# EAGLE schematic IAS_v005 (EAGLE 7.3.0)
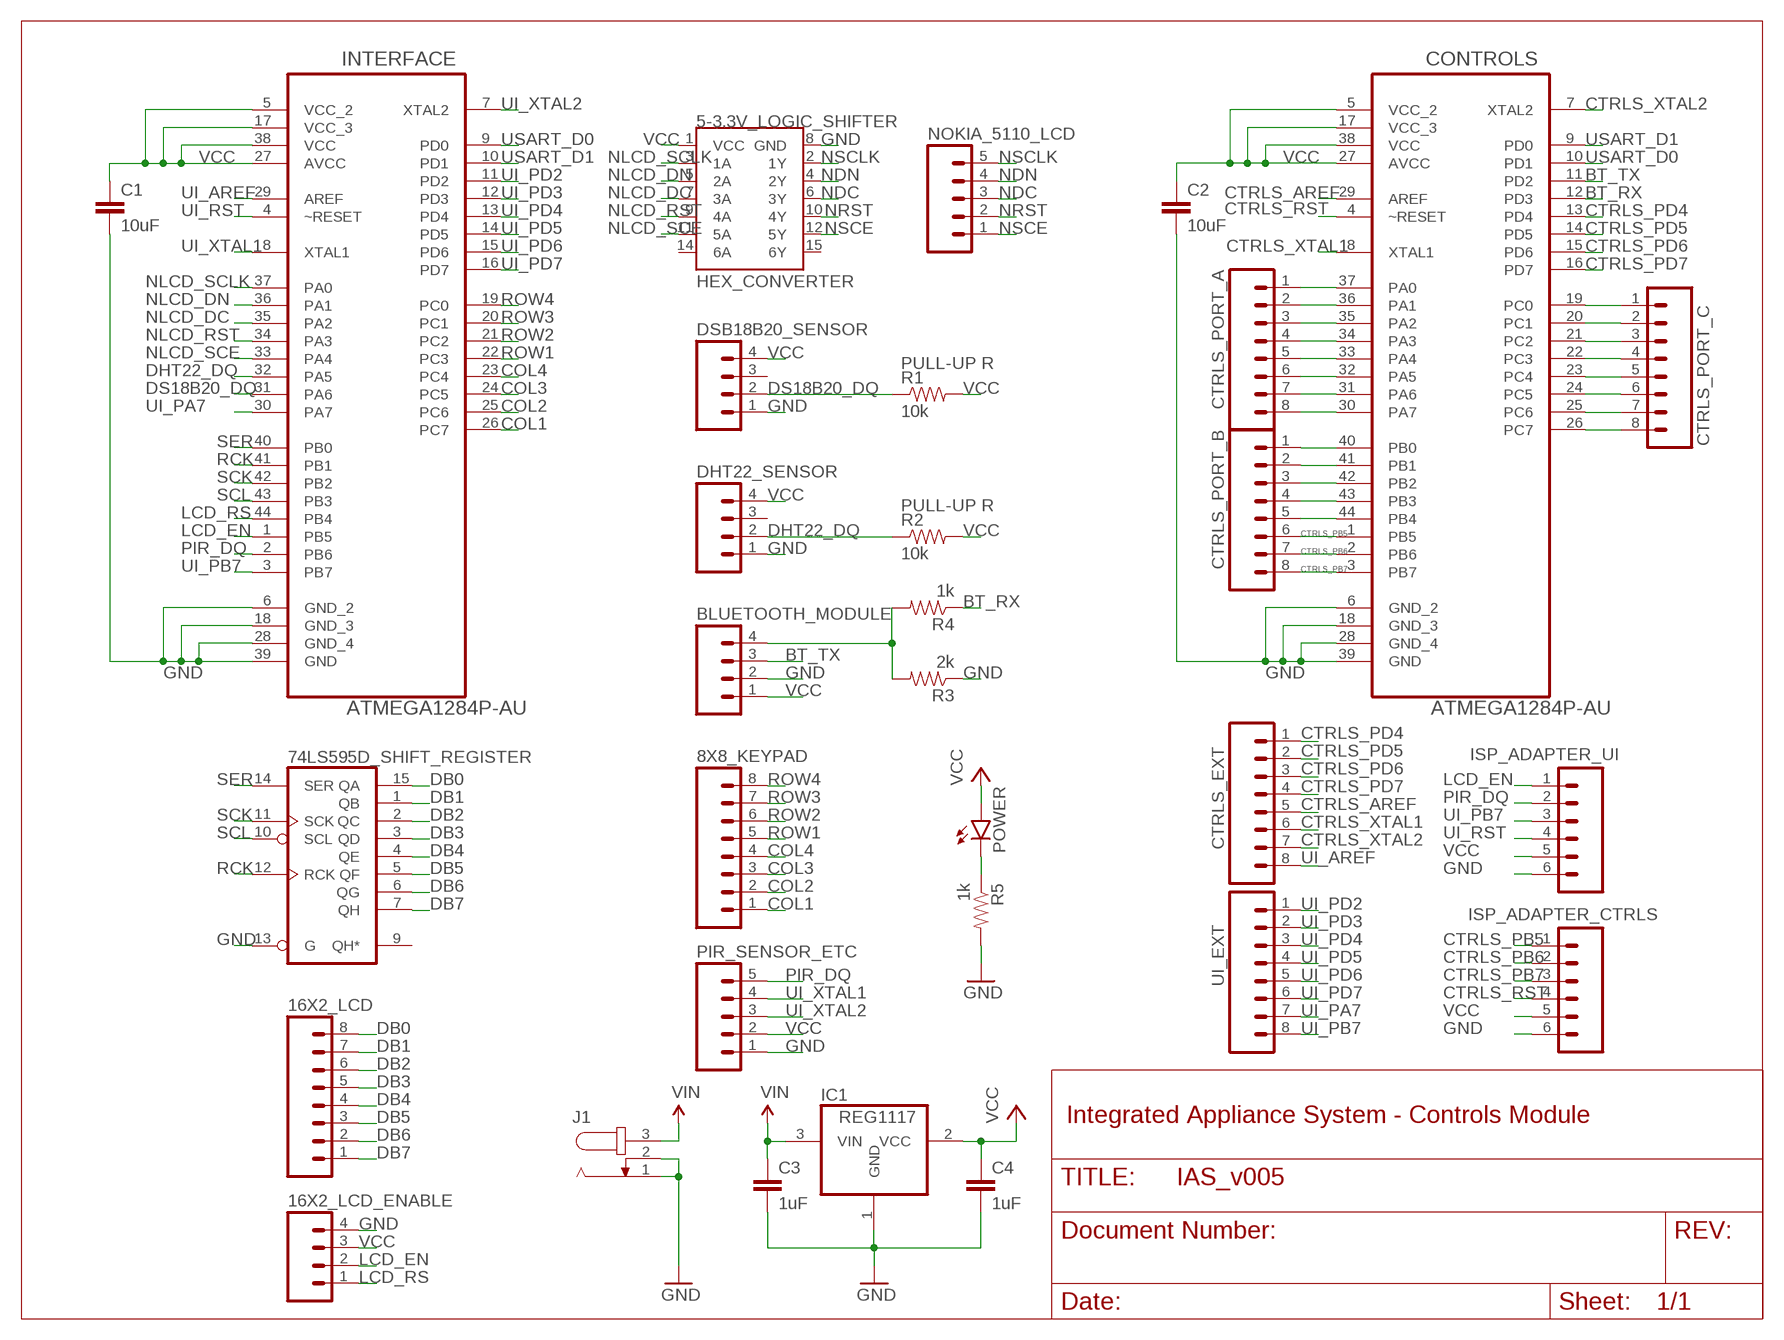
[diagram p0: schematic, sheet 1]

## Parts
5-3.3V_LOGIC_SHIFTER  HEX_CONVERTER  [SO016]
8X8_KEYPAD  M08  [1X08_ROUND]
16X2_LCD  M08  [1X08_ROUND]
16X2_LCD_ENABLE  M04NO_SILK_ALL_ROUND  [1X04_NO_SILK_ALL_ROUND]
74LS595D_SHIFT_REGISTER  74LS595D  [SO16]
BLUETOOTH_MODULE  M04NO_SILK_ALL_ROUND  [1X04_NO_SILK_ALL_ROUND]
C1  10uF  CAP1206  [1206]
C2  10uF  CAP1206  [1206]
C3  1uF  CAP1206  [1206]
C4  1uF  CAP1206  [1206]
CONTROLS  ATMEGA1284P-AU  [QFP80P1200X1200X120-44N]
CTRLS_EXT  M08  [1X08_ROUND]
CTRLS_PORT_A  M08  [1X08_ROUND]
CTRLS_PORT_B  M08  [1X08_ROUND]
CTRLS_PORT_C  M08  [1X08_ROUND]
DHT22_SENSOR  M04NO_SILK_ALL_ROUND  [1X04_NO_SILK_ALL_ROUND]
DSB18B20_SENSOR  M04NO_SILK_ALL_ROUND  [1X04_NO_SILK_ALL_ROUND]
IC1  REG1117  [SOT223]
INTERFACE  ATMEGA1284P-AU  [QFP80P1200X1200X120-44N]
ISP_ADAPTER_CTRLS  M06SILK_FEMALE_PTH  [1X06]
ISP_ADAPTER_UI  M06SILK_FEMALE_PTH  [1X06]
J1  JACK-PLUG0  [SPC4077]
NOKIA_5110_LCD  M05PTH  [1X05]
PIR_SENSOR_ETC  M05PTH  [1X05]
POWER  LED3MM  [LED3MM]
R1  10k  RESISTOR1206  [1206]
R2  10k  RESISTOR1206  [1206]
R3  2k  RESISTOR1206  [1206]
R4  1k  RESISTOR1206  [1206]
R5  1k  RESISTOR1206  [1206]
UI_EXT  M08  [1X08_ROUND]

## Nets
BT_RX: CONTROLS.12(PD3) R4.1
BT_TX: BLUETOOTH_MODULE.3 CONTROLS.11(PD2)
COL1: 8X8_KEYPAD.1 INTERFACE.26(PC7)
COL2: 8X8_KEYPAD.2 INTERFACE.25(PC6)
COL3: 8X8_KEYPAD.3 INTERFACE.24(PC5)
COL4: 8X8_KEYPAD.4 INTERFACE.23(PC4)
CTRLS_AREF: CONTROLS.29(AREF) CTRLS_EXT.5
CTRLS_PA0: CONTROLS.37(PA0) CTRLS_PORT_A.1
CTRLS_PA1: CONTROLS.36(PA1) CTRLS_PORT_A.2
CTRLS_PA2: CONTROLS.35(PA2) CTRLS_PORT_A.3
CTRLS_PA3: CONTROLS.34(PA3) CTRLS_PORT_A.4
CTRLS_PA4: CONTROLS.33(PA4) CTRLS_PORT_A.5
CTRLS_PA5: CONTROLS.32(PA5) CTRLS_PORT_A.6
CTRLS_PA6: CONTROLS.31(PA6) CTRLS_PORT_A.7
CTRLS_PA7: CONTROLS.30(PA7) CTRLS_PORT_A.8
CTRLS_PB0: CONTROLS.40(PB0) CTRLS_PORT_B.1
CTRLS_PB1: CONTROLS.41(PB1) CTRLS_PORT_B.2
CTRLS_PB2: CONTROLS.42(PB2) CTRLS_PORT_B.3
CTRLS_PB3: CONTROLS.43(PB3) CTRLS_PORT_B.4
CTRLS_PB4: CONTROLS.44(PB4) CTRLS_PORT_B.5
CTRLS_PB5: CONTROLS.1(PB5) CTRLS_PORT_B.6 ISP_ADAPTER_CTRLS.1
CTRLS_PB6: CONTROLS.2(PB6) CTRLS_PORT_B.7 ISP_ADAPTER_CTRLS.2
CTRLS_PB7: CONTROLS.3(PB7) CTRLS_PORT_B.8 ISP_ADAPTER_CTRLS.3
CTRLS_PC0: CONTROLS.19(PC0) CTRLS_PORT_C.1
CTRLS_PC1: CONTROLS.20(PC1) CTRLS_PORT_C.2
CTRLS_PC2: CONTROLS.21(PC2) CTRLS_PORT_C.3
CTRLS_PC3: CONTROLS.22(PC3) CTRLS_PORT_C.4
CTRLS_PC4: CONTROLS.23(PC4) CTRLS_PORT_C.5
CTRLS_PC5: CONTROLS.24(PC5) CTRLS_PORT_C.6
CTRLS_PC6: CONTROLS.25(PC6) CTRLS_PORT_C.7
CTRLS_PC7: CONTROLS.26(PC7) CTRLS_PORT_C.8
CTRLS_PD4: CONTROLS.13(PD4) CTRLS_EXT.1
CTRLS_PD5: CONTROLS.14(PD5) CTRLS_EXT.2
CTRLS_PD6: CONTROLS.15(PD6) CTRLS_EXT.3
CTRLS_PD7: CONTROLS.16(PD7) CTRLS_EXT.4
CTRLS_RST: CONTROLS.4(~RESET) ISP_ADAPTER_CTRLS.4
CTRLS_XTAL1: CONTROLS.8(XTAL1) CTRLS_EXT.6
CTRLS_XTAL2: CONTROLS.7(XTAL2) CTRLS_EXT.7
DB0: 16X2_LCD.8 74LS595D_SHIFT_REGISTER.15(QA)
DB1: 16X2_LCD.7 74LS595D_SHIFT_REGISTER.1(QB)
DB2: 16X2_LCD.6 74LS595D_SHIFT_REGISTER.2(QC)
DB3: 16X2_LCD.5 74LS595D_SHIFT_REGISTER.3(QD)
DB4: 16X2_LCD.4 74LS595D_SHIFT_REGISTER.4(QE)
DB5: 16X2_LCD.3 74LS595D_SHIFT_REGISTER.5(QF)
DB6: 16X2_LCD.2 74LS595D_SHIFT_REGISTER.6(QG)
DB7: 16X2_LCD.1 74LS595D_SHIFT_REGISTER.7(QH)
DHT22_DQ: DHT22_SENSOR.2 INTERFACE.32(PA5) R2.1
DS18B20_DQ: DSB18B20_SENSOR.2 INTERFACE.31(PA6) R1.1
GND: 5-3.3V_LOGIC_SHIFTER.8(GND) 16X2_LCD_ENABLE.4 74LS595D_SHIFT_REGISTER.13(G) BLUETOOTH_MODULE.2 C1.2 C2.2 C3.2 C4.2 CONTROLS.6(GND_2) CONTROLS.18(GND_3) CONTROLS.28(GND_4) CONTROLS.39(GND) DHT22_SENSOR.1 DSB18B20_SENSOR.1 IC1.1(GND) INTERFACE.6(GND_2) INTERFACE.18(GND_3) INTERFACE.28(GND_4) INTERFACE.39(GND) ISP_ADAPTER_CTRLS.6 ISP_ADAPTER_UI.6 J1.1 J1.2 PIR_SENSOR_ETC.1 R3.1 R5.2
LCD_EN: 16X2_LCD_ENABLE.2 INTERFACE.1(PB5) ISP_ADAPTER_UI.1
LCD_RS: 16X2_LCD_ENABLE.1 INTERFACE.44(PB4)
N$2: POWER.K(C) R5.1
N$7: BLUETOOTH_MODULE.4 R3.2 R4.2
NDC: 5-3.3V_LOGIC_SHIFTER.6(3Y) NOKIA_5110_LCD.3
NDN: 5-3.3V_LOGIC_SHIFTER.4(2Y) NOKIA_5110_LCD.4
NLCD_DC: 5-3.3V_LOGIC_SHIFTER.7(3A) INTERFACE.35(PA2)
NLCD_DN: 5-3.3V_LOGIC_SHIFTER.5(2A) INTERFACE.36(PA1)
NLCD_RST: 5-3.3V_LOGIC_SHIFTER.9(4A) INTERFACE.34(PA3)
NLCD_SCE: 5-3.3V_LOGIC_SHIFTER.11(5A) INTERFACE.33(PA4)
NLCD_SCLK: 5-3.3V_LOGIC_SHIFTER.3(1A) INTERFACE.37(PA0)
NRST: 5-3.3V_LOGIC_SHIFTER.10(4Y) NOKIA_5110_LCD.2
NSCE: 5-3.3V_LOGIC_SHIFTER.12(5Y) NOKIA_5110_LCD.1
NSCLK: 5-3.3V_LOGIC_SHIFTER.2(1Y) NOKIA_5110_LCD.5
PIR_DQ: INTERFACE.2(PB6) ISP_ADAPTER_UI.2 PIR_SENSOR_ETC.5
RCK: 74LS595D_SHIFT_REGISTER.12(RCK) INTERFACE.41(PB1)
ROW1: 8X8_KEYPAD.5 INTERFACE.22(PC3)
ROW2: 8X8_KEYPAD.6 INTERFACE.21(PC2)
ROW3: 8X8_KEYPAD.7 INTERFACE.20(PC1)
ROW4: 8X8_KEYPAD.8 INTERFACE.19(PC0)
SCK: 74LS595D_SHIFT_REGISTER.11(SCK) INTERFACE.42(PB2)
SCL: 74LS595D_SHIFT_REGISTER.10(SCL) INTERFACE.43(PB3)
SER: 74LS595D_SHIFT_REGISTER.14(SER) INTERFACE.40(PB0)
UI_AREF: CTRLS_EXT.8 INTERFACE.29(AREF)
UI_PA7: INTERFACE.30(PA7) UI_EXT.7
UI_PB7: INTERFACE.3(PB7) ISP_ADAPTER_UI.3 UI_EXT.8
UI_PD2: INTERFACE.11(PD2) UI_EXT.1
UI_PD3: INTERFACE.12(PD3) UI_EXT.2
UI_PD4: INTERFACE.13(PD4) UI_EXT.3
UI_PD5: INTERFACE.14(PD5) UI_EXT.4
UI_PD6: INTERFACE.15(PD6) UI_EXT.5
UI_PD7: INTERFACE.16(PD7) UI_EXT.6
UI_RST: INTERFACE.4(~RESET) ISP_ADAPTER_UI.4
UI_XTAL1: INTERFACE.8(XTAL1) PIR_SENSOR_ETC.4
UI_XTAL2: INTERFACE.7(XTAL2) PIR_SENSOR_ETC.3
USART_D0: CONTROLS.10(PD1) INTERFACE.9(PD0)
USART_D1: CONTROLS.9(PD0) INTERFACE.10(PD1)
VCC: 5-3.3V_LOGIC_SHIFTER.1(VCC) 16X2_LCD_ENABLE.3 BLUETOOTH_MODULE.1 C1.1 C2.1 C4.1 CONTROLS.5(VCC_2) CONTROLS.17(VCC_3) CONTROLS.27(AVCC) CONTROLS.38(VCC) DHT22_SENSOR.4 DSB18B20_SENSOR.4 IC1.2(VCC) INTERFACE.5(VCC_2) INTERFACE.17(VCC_3) INTERFACE.27(AVCC) INTERFACE.38(VCC) ISP_ADAPTER_CTRLS.5 ISP_ADAPTER_UI.5 PIR_SENSOR_ETC.2 POWER.A R1.2 R2.2
VIN: C3.1 IC1.3(VIN) J1.3
Unconnected: 5-3.3V_LOGIC_SHIFTER.14(6A) 5-3.3V_LOGIC_SHIFTER.15(6Y) 74LS595D_SHIFT_REGISTER.9(QH*) DHT22_SENSOR.3 DSB18B20_SENSOR.3

## Notes on the sheet
- PULL-UP R
- PULL-UP R
- Integrated Appliance System - Controls Module

## Power pins joined to a net without a drawn wire
GND: 74LS595D_SHIFT_REGISTER.8(GND)
VCC: 74LS595D_SHIFT_REGISTER.16(VCC)

## Library data of the parts
5-3.3V_LOGIC_SHIFTER = SparkFun-DigitalIC:HEX_CONVERTER: 74HC4050 Hex Buffer Level Shifter SMD SO016; MPN: 74HC4050D,652; OC_NEWARK: 71R2496; PROD_ID: IC-09604
8X8_KEYPAD 16X2_LCD CTRLS_EXT CTRLS_PORT_A CTRLS_PORT_B CTRLS_PORT_C UI_EXT = SparkFun-Connectors:M08: Header 8 Standard 8-pin 0.1" header. Use with straight break away headers (SKU : PRT-00116), right angle break away headers (PRT-00553), swiss pins (PRT-00743), machine pins (PRT-00117), and female headers (PRT-00115).; OC_NEWARK: unknown
16X2_LCD_ENABLE BLUETOOTH_MODULE DHT22_SENSOR DSB18B20_SENSOR = SparkFun-Connectors:M04: Header 4 Standard 4-pin 0.1" header. Use with straight break away headers (SKU : PRT-00116), right angle break away headers (PRT-00553), swiss pins (PRT-00743), machine pins (PRT-00117), and female headers (PRT-00115). Molex polarized connector foot print use with SKU : PRT-08231 with associated crimp pins and housings. 1MM SMD Version SKU: PRT-10208; OC_NEWARK: unknown
74LS595D_SHIFT_REGISTER = 74xx-us:74*595: 8-bit SHIFT REGISTER, output latch; MPN: SN74LS595D; OC_NEWARK: 34R8835
C1-C4 = SparkFun-Capacitors:CAP: Capacitor Standard 0603 ceramic capacitor, and 0.1" leaded capacitor.; OC_NEWARK: unknown
CONTROLS INTERFACE = Atmel_By_element14_Batch_1-00:ATMEGA1284P-AU: Microcontroller with Programmable Flash; OC_FARNELL: 1715480; OC_NEWARK: unknown; PACKAGE: TQFP-44; SUPPLIER: Atmel
IC1 = sergio:REG1117: 800mA and 1A Low Dropout (LDO) Positive Regulator 1.8V, 2.5V, 2.85V, 3.3V, 5V, and Adj; MPN: REG1117; OC_FARNELL: 1097566; OC_NEWARK: 14P6981
ISP_ADAPTER_CTRLS ISP_ADAPTER_UI = SparkFun-Connectors:M06: Header 6 Standard 6-pin 0.1" header. Use with straight break away headers (SKU : PRT-00116), right angle break away headers (PRT-00553), swiss pins (PRT-00743), machine pins (PRT-00117), and female headers (PRT-00115). Molex polarized connector foot print use with SKU : PRT-08094 with associated crimp pins and housings. NOTES ON THE VARIANTS LOCK and LOCK_LONGPADS... This footprint was designed to help hold the alignment of a through-hole component (i.e. 6-pin header) while soldering it into place. You may notice that each hole has been shifted either up or down by 0.005 of an inch from it's more standard position (which is a perfectly straight line). This slight alteration caused the pins (the squares in the middle) to touch the edges of the holes. Because they are alternating, it causes a "brace" to hold the component in place. 0.005 has proven to be the perfect amount of "off-center" position when using our standard breakaway headers. Although looks a little odd when you look at the bare footprint, once you have a header in there, the alteration is very hard to notice. Also,if you push a header all the way into place, it is covered up entirely on the bottom side. This idea of altering the position of holes to aid alignment will be further integrated into the Sparkfun Library for other footprints. It can help hold any component with 3 or more connection pins.; OC_NEWARK: unknown; PROD_ID: CONN-08437
J1 = con-jack:JACK-PLUG: DC POWER JACK Power Jack, DC, Right Angle, Through Hole, Rated 5A at 16VDC, PC Terminals Distributor: Farnell (www.Farnell.de) Drawing: 84N1161.pdf / 84N1162.pdf Manufacturer: SPC Technology (www.spctechnology.com) Type: SPC4077 / SPC 4078; OC_FARNELL: unknown; OC_NEWARK: unknown
NOKIA_5110_LCD PIR_SENSOR_ETC = SparkFun-Connectors:M05: Header 5 Standard 5-pin 0.1" header. Use with straight break away headers (SKU : PRT-00116), right angle break away headers (PRT-00553), swiss pins (PRT-00743), machine pins (PRT-00117), and female headers (PRT-00115). Molex polarized connector foot print use with SKU : PRT-08230 with associated crimp pins and housings.; OC_NEWARK: unknown
POWER = SparkFun-LED:LED: LEDs Standard schematic elements and footprints for 5mm, 3mm, 1206, and 0603 sized LEDs. 5mm - Spark Fun Electronics SKU : COM-00529 (and others)
R1-R5 = SparkFun-Resistors:RESISTOR: Resistor Basic schematic elements and footprints for 0603, 1206, and PTH resistors.; OC_NEWARK: unknown